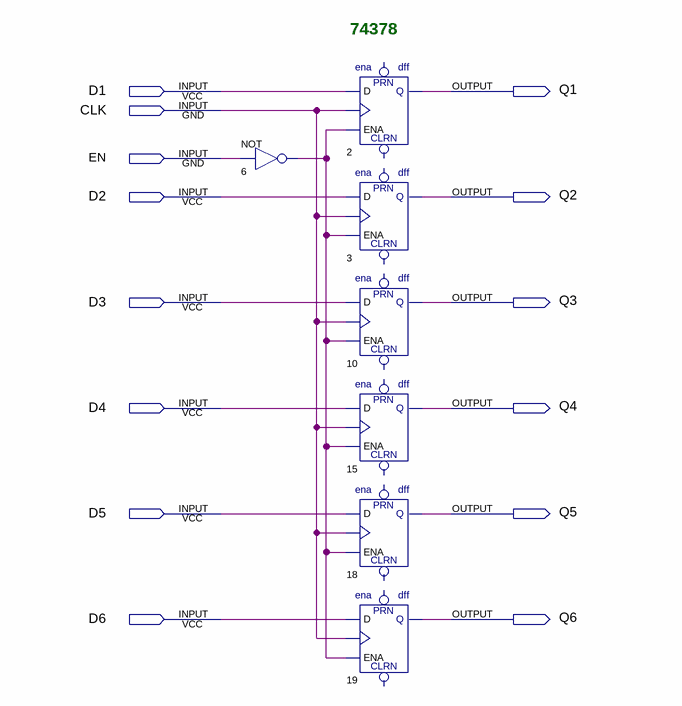
[diagram p0: schematic sheet]
// Quartus schematic 74378.bdf as structural Verilog: 7 symbols, 14 pins
module \74378  (
  input  D1,
  input  CLK,
  input  EN,
  input  D2,
  input  D3,
  input  D4,
  input  D5,
  input  D6,
  output Q1,
  output Q2,
  output Q3,
  output Q4,
  output Q5,
  output Q6
);

  wire n6_out;

  not u_6 (n6_out, EN);
  enadff u_2 (.ENA(n6_out), .D(D1), .CLK(CLK), .Q(Q1));  // open: PRN, CLRN
  enadff u_3 (.ENA(n6_out), .D(D2), .CLK(CLK), .Q(Q2));  // open: PRN, CLRN
  enadff u_10 (.ENA(n6_out), .D(D3), .CLK(CLK), .Q(Q3));  // open: PRN, CLRN
  enadff u_15 (.ENA(n6_out), .D(D4), .CLK(CLK), .Q(Q4));  // open: PRN, CLRN
  enadff u_18 (.ENA(n6_out), .D(D5), .CLK(CLK), .Q(Q5));  // open: PRN, CLRN
  enadff u_19 (.ENA(n6_out), .D(D6), .CLK(CLK), .Q(Q6));  // open: PRN, CLRN

  // Notes on the sheet:
  //   74378
endmodule
